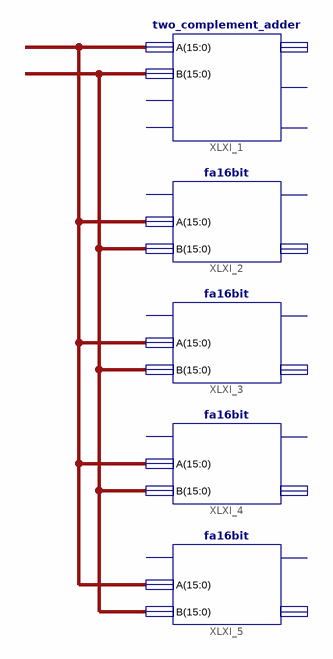
[diagram p0: schematic sheet 1]
// Xilinx ISE schematic ALU_16bit.sch (virtex6) as structural Verilog: 5 symbols, 0 ports
module ALU_16bit (
);

  wire [15:0] XLXN_4, XLXN_8;

  two_complement_adder XLXI_1 (.A(XLXN_4), .B(XLXN_8));  // open: CI, mode, S, Cout, V
  fa16bit XLXI_2 (.A(XLXN_4), .B(XLXN_8));  // open: CI, Co, S
  fa16bit XLXI_3 (.A(XLXN_4), .B(XLXN_8));  // open: CI, Co, S
  fa16bit XLXI_4 (.A(XLXN_4), .B(XLXN_8));  // open: CI, Co, S
  fa16bit XLXI_5 (.A(XLXN_4), .B(XLXN_8));  // open: CI, Co, S
endmodule
